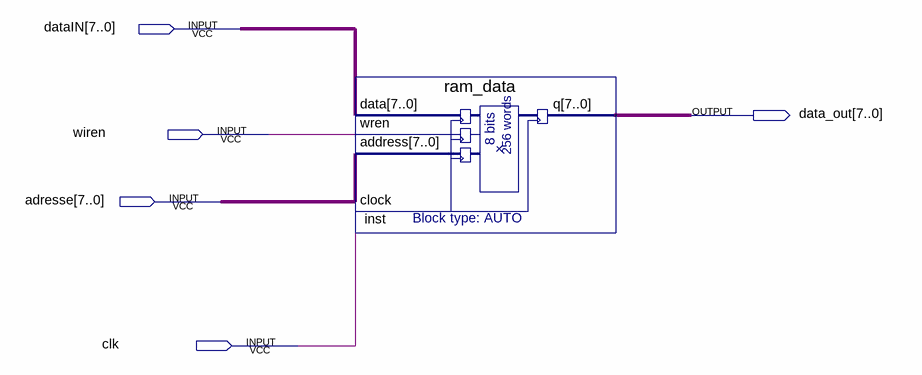
[diagram p0: schematic sheet]
// Quartus schematic memoireRAM.bdf as structural Verilog: 1 symbols, 5 pins
module memoireRAM (
  input  [7:0] dataIN,
  input  wiren,
  input  [7:0] adresse,
  input  clk,
  output [7:0] data_out
);

  ram_data inst (.data(dataIN), .wren(wiren), .address(adresse), .clock(clk), .q(data_out));
endmodule
